# EAGLE design board (EAGLE 7.2.0)
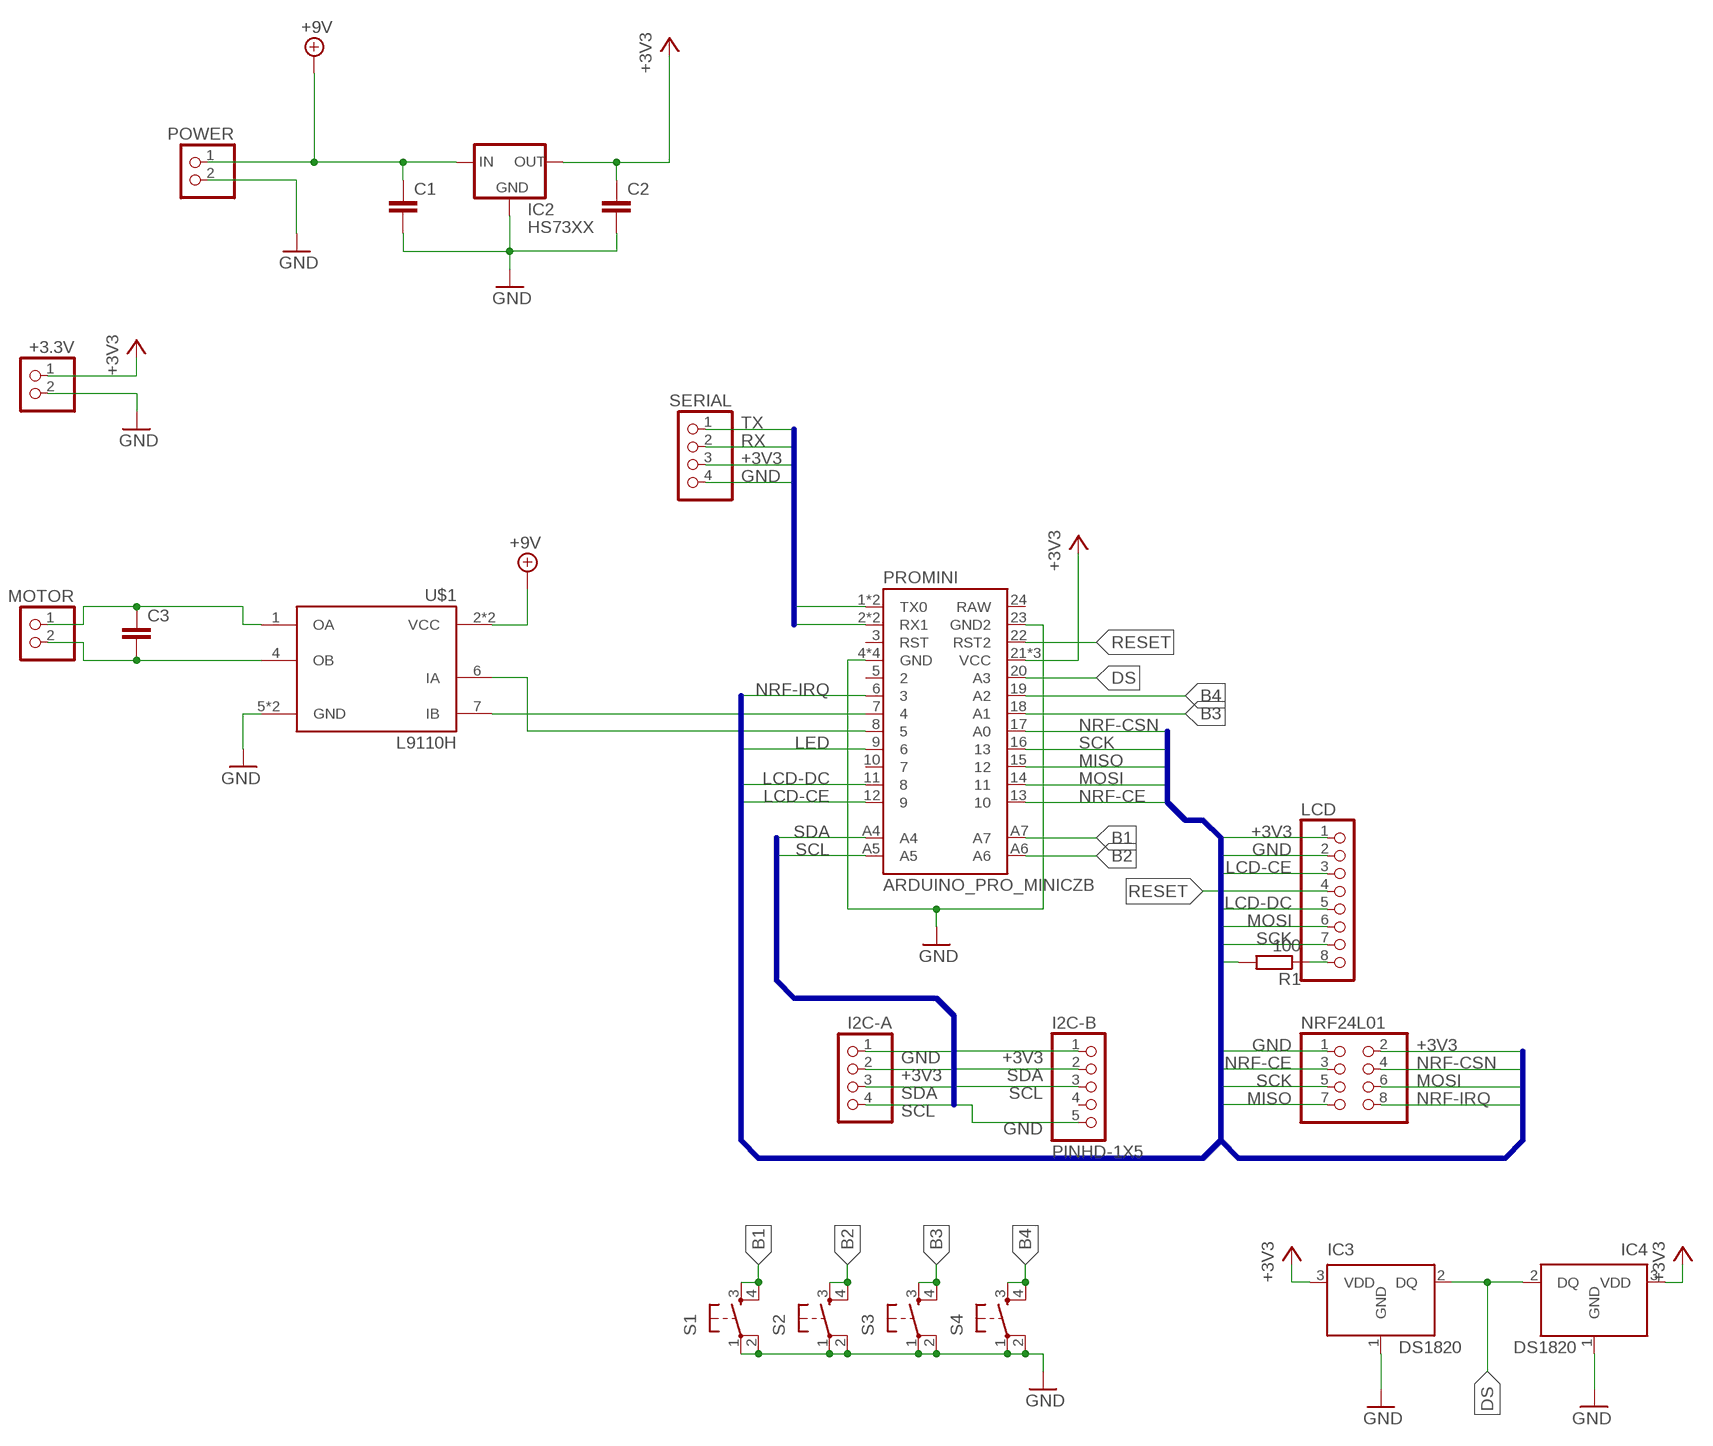
[diagram p0: schematic, sheet 1]

## Parts
+3.3V  PINHD-1X2  [1X02]
C1  C-EU025-024X044  [C025-024X044]
C2  C-EU025-024X044  [C025-024X044]
C3  C-EU025-024X044  [C025-024X044]
I2C-A  PINHD-1X4  [1X04]
I2C-B  PINHD-1X5  [1X05]
IC2  HS73XX  [TO92]
IC3  DS1820  [TO-92]
IC4  DS1820  [TO-92]
LCD  PINHD-1X8  [1X08]
MOTOR  PINHD-1X2  [1X02]
NRF24L01  PINHD-2X4  [2X04]
POWER  PINHD-1X2  [1X02]
PROMINI  ARDUINO_PRO_MINICZB  [PRO_MINI_2]
R1  100  R-EU_0204/7  [0204/7]
S1  TAC_SWITCHPTH  [TACTILE-PTH]
S2  TAC_SWITCHPTH  [TACTILE-PTH]
S3  TAC_SWITCHPTH  [TACTILE-PTH]
S4  TAC_SWITCHPTH  [TACTILE-PTH]
SERIAL  PINHD-1X4  [1X04]
U$1  L9110H  [DIL08]

## Nets
1Y: C3.1 MOTOR.1 U$1.1(OA)
2Y: C3.2 MOTOR.2 U$1.4(OB)
+3V3: +3.3V.1 C2.1 I2C-A.2 I2C-B.1 IC2.3(OUT) IC3.3(VDD) IC4.3(VDD) LCD.1 NRF24L01.2 PROMINI.21(VCC) PROMINI.V(VCC) PROMINI.VCC SERIAL.3
+9V: C1.1 IC2.2(IN) POWER.1 U$1.2(VCC) U$1.3(VCC)
B1: PROMINI.A7 S1.3 S1.4
B2: PROMINI.A6 S2.3 S2.4
B3: PROMINI.18(A1) S3.3 S3.4
B4: PROMINI.19(A2) S4.3 S4.4
DS: IC3.2(DQ) IC4.2(DQ) PROMINI.20(A3)
GND: +3.3V.2 C1.2 C2.2 I2C-A.1 I2C-B.5 IC2.1(GND) IC3.1(GND) IC4.1(GND) LCD.2 NRF24L01.1 POWER.2 PROMINI.4(GND) PROMINI.23(GND2) PROMINI.BLK(GND) PROMINI.G(GND) PROMINI.GND S1.1 S1.2 S2.1 S2.2 S3.1 S3.2 S4.1 S4.2 SERIAL.4 U$1.5(GND) U$1.8(GND)
LCD-CE: LCD.3 PROMINI.12
LCD-DC: LCD.5 PROMINI.11
LED: PROMINI.9 R1.2
LED-LCD: LCD.8 R1.1
MISO: NRF24L01.7 PROMINI.15
MOSI: LCD.6 NRF24L01.6 PROMINI.14
N$1: PROMINI.8 U$1.6(IA)
N$3: PROMINI.7 U$1.7(IB)
NRF-CE: NRF24L01.3 PROMINI.13
NRF-CSN: NRF24L01.4 PROMINI.17(A0)
NRF-IRQ: NRF24L01.8 PROMINI.6
RESET: LCD.4 PROMINI.22(RST2)
RX: PROMINI.2(RX1) PROMINI.RXI(RX1) SERIAL.2
SCK: LCD.7 NRF24L01.5 PROMINI.16
SCL: I2C-A.4 I2C-B.3 PROMINI.A5
SDA: I2C-A.3 I2C-B.2 PROMINI.A4
TX: PROMINI.1(TX0) PROMINI.TXO(TX0) SERIAL.1
Unconnected: I2C-B.4 PROMINI.3(RST) PROMINI.5 PROMINI.10 PROMINI.24(RAW)

## Buses
SDA,SCL,+3V3,GND
+3V3,GND,SCK,MISO,MOSI,NRF-CE,NRF-CSN,NRF-IRQ,LCD-CE,LCD-DC,LED
TX,RX,+3V3,GND

## Library data of the parts
+3.3V MOTOR POWER = pinhead:PINHD-1X2: PIN HEADER
C1-C3 = rcl:C-EU: CAPACITOR, European symbol
I2C-A SERIAL = board:PINHD-1X4: PIN HEADER
I2C-B = board:PINHD-1X5
IC2 = board:HS73XX
IC3 IC4 = DS1820:DS1820: DS1820 - 1-Wire Digital Thermometer
LCD = board:PINHD-1X8: PIN HEADER
NRF24L01 = board:PINHD-2X4: PIN HEADER
PROMINI = board:ARDUINO_PRO_MINI: Chinese version of the Arduino Mini Pro Link to eBay item <http://www.ebay.it/itm/131053554958>
R1 = rcl:R-EU_: RESISTOR, European symbol
S1-S4 = SparkFun-Electromechanical:TAC_SWITCH: Momentary Switch Button commonly used for reset or general input. Spark Fun Electronics SKU : COM-00097 SMT- SWCH-08247
U$1 = board:L9110H

## Net classes
0 default: clearance 0.205 mm

## Board
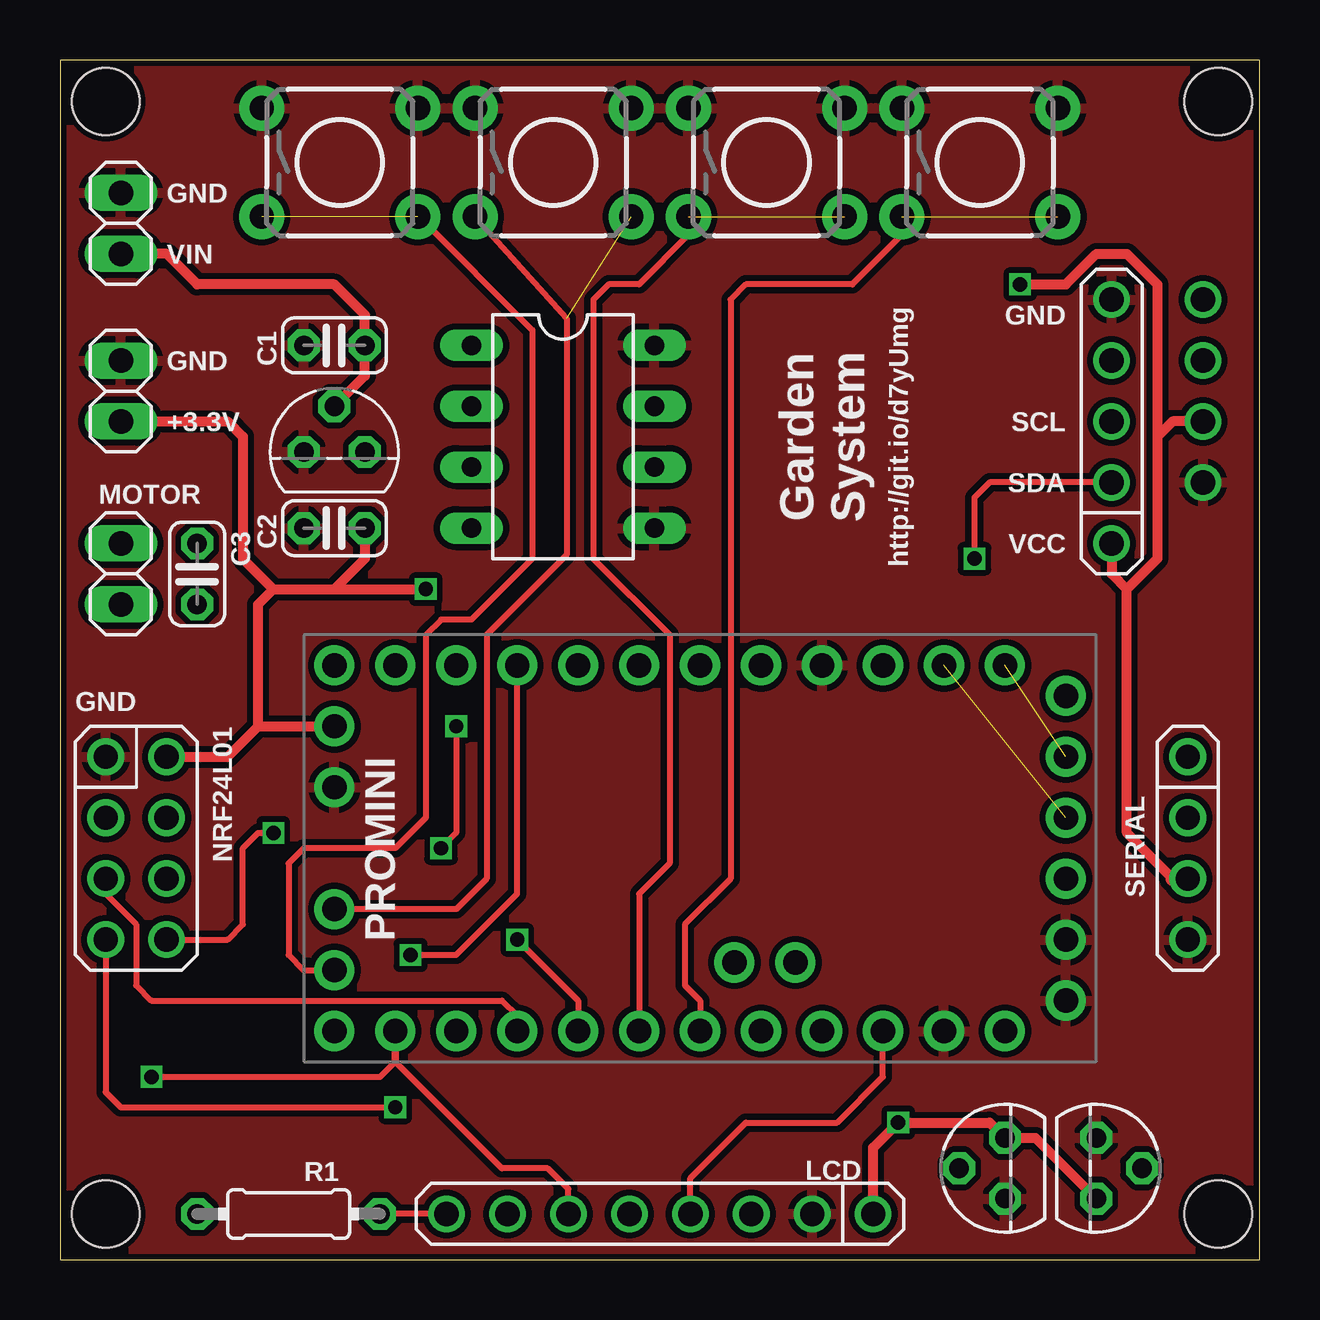
[diagram p1: board, top side]
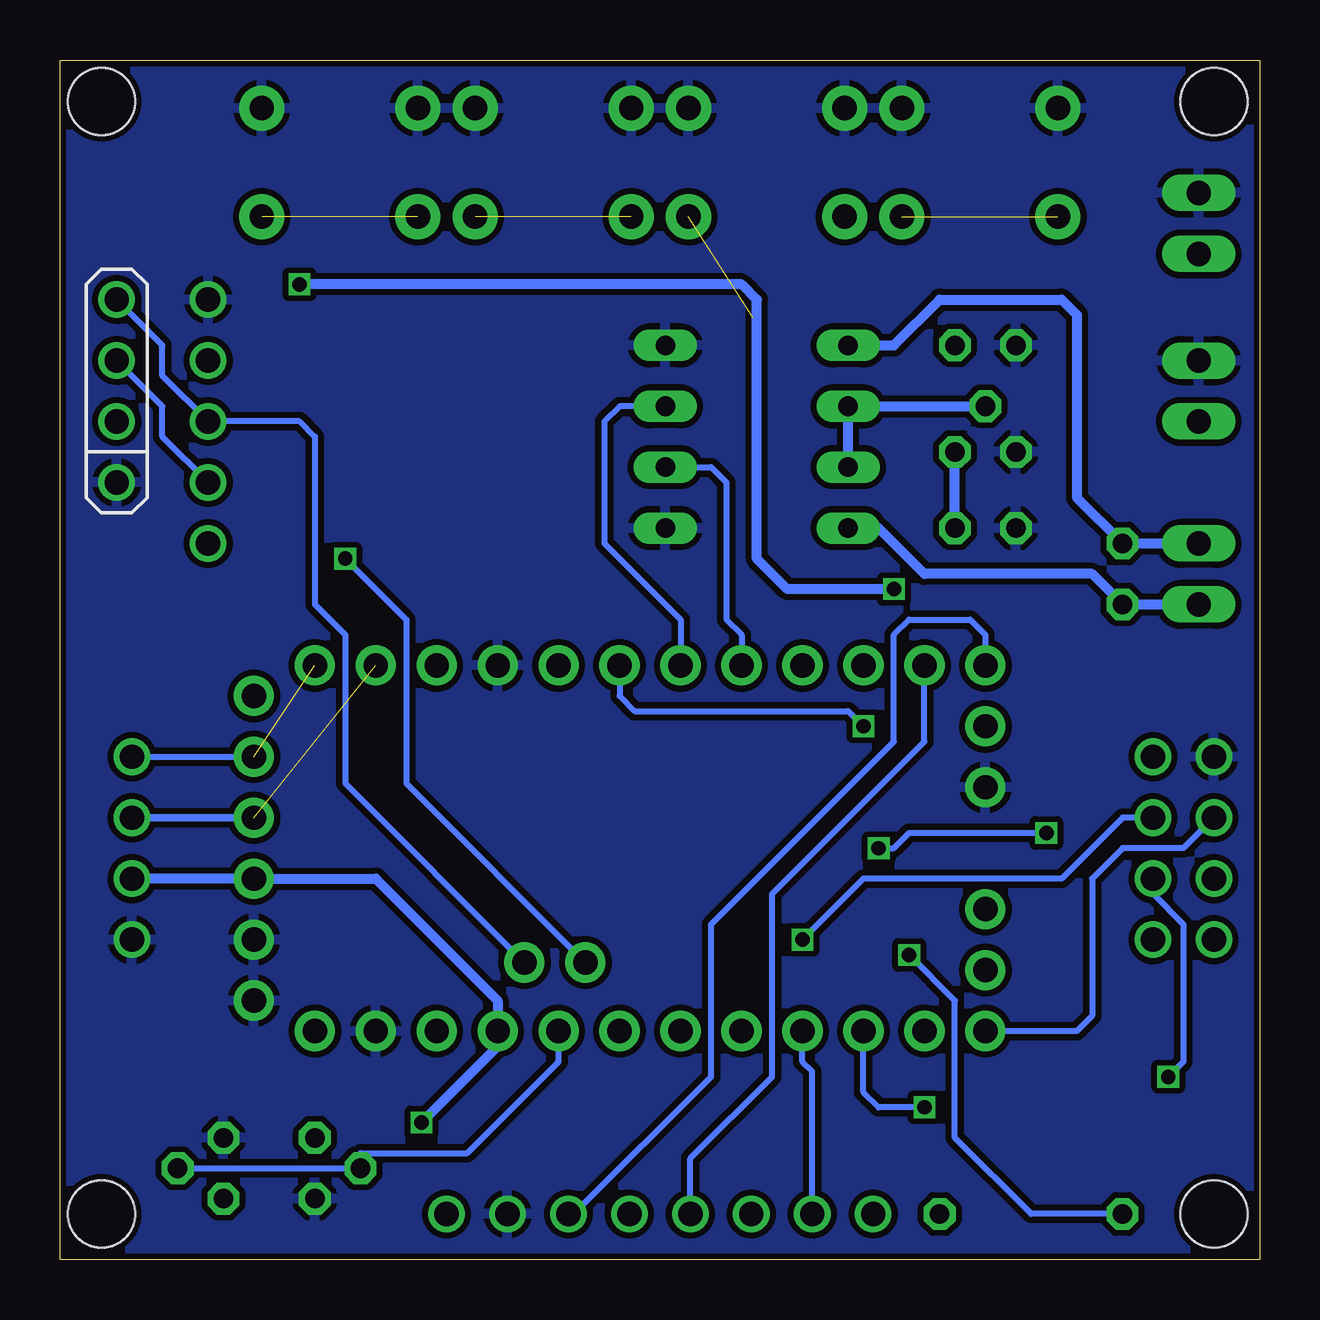
[diagram p2: board, bottom side, seen from below]

Size 49.99 x 49.99 mm. Coordinates in mm from the lower left corner, seen from the top.
Outline: 0,0 49.99,0 49.99,49.99 0,49.99 0,0
Copper layers (1*16): Top 0.035mm / dielectric 1.5mm / Bottom 0.035mm
Design rules "ITEADstudio_DRC": minimum track width 6mil, minimum drill 12mil, track to track 6mil, track to pad 6mil, pad to pad 6mil, via to via 6mil, smd to smd 0mil, copper to edge 10mil, drill to drill 10mil, minimum pad ring 10mil, minimum via ring 6mil, stop-mask expansion 2mil, vias tented up to drill 100mil, thermal gap 10mil
Holes 2.8 mm at 48.26,1.91 1.91,48.26 48.26,48.26 1.91,1.91

### Footprints (pad centres in the part's own frame; a part is rotated, then mirrored left to right if it is on the bottom)
1X02 = drill 1.016 long: 1 -1.27,0; 2 1.27,0
C025-024X044 = drill 0.813 octagon: 1 -1.27,0; 2 1.27,0
1X04 = drill 1.016: 1 -3.81,0; 2 -1.27,0; 3 1.27,0; 4 3.81,0
1X05 = drill 1.016: 1 -5.08,0; 2 -2.54,0; 3 0,0; 4 2.54,0; 5 5.08,0
TO92 = drill 0.813 octagon: 1 -1.27,-0.635; 2 0,1.27; 3 1.27,-0.635
TO-92 = drill 0.813 pad 1.27 octagon: 1 -1.27,0; 2 0,1.905; 3 1.27,0
1X08 = drill 1.016: 1 -8.89,0; 2 -6.35,0; 3 -3.81,0; 4 -1.27,0; 5 1.27,0; 6 3.81,0; 7 6.35,0; 8 8.89,0
2X04 = drill 1.016: 1 -3.81,-1.27; 2 -3.81,1.27; 3 -1.27,-1.27; 4 -1.27,1.27; 5 1.27,-1.27; 6 1.27,1.27; 7 3.81,-1.27; 8 3.81,1.27
PRO_MINI_2 = drill 1.016 pad 1.676: 1 -7.62,12.7; 2 -7.62,10.16; 3 -7.62,7.62; 4 -7.62,5.08; 5 -7.62,2.54; 6 -7.62,0; 7 -7.62,-2.54; 8 -7.62,-5.08; 9 -7.62,-7.62; 10 -7.62,-10.16; 11 -7.62,-12.7; 12 -7.62,-15.24; 13 7.62,-15.24; 14 7.62,-12.7; 15 7.62,-10.16; 16 7.62,-7.62; 17 7.62,-5.08; 18 7.62,-2.54; 19 7.62,0; 20 7.62,2.54; 21 7.62,5.08; 22 7.62,7.62; 23 7.62,10.16; 24 7.62,12.7; A4 4.763,1.429; A5 4.763,3.969; A6 2.54,-15.24; A7 5.08,-15.24; BLK 6.35,15.24; G -2.54,-15.24; GND 3.81,15.24; GRN -6.35,15.24; RXI -1.27,15.24; TXO -3.81,15.24; V -5.08,-15.24; VCC 1.27,15.24
0204/7 = drill 0.813 octagon: 1 -3.81,0; 2 3.81,0
TACTILE-PTH = drill 1.016 pad 1.88: 1 -3.251,2.261; 2 3.251,2.261; 3 -3.251,-2.261; 4 3.251,-2.261
DIL08 = drill 0.813 long: 1 -3.81,-3.81; 2 -1.27,-3.81; 3 1.27,-3.81; 4 3.81,-3.81; 5 3.81,3.81; 6 1.27,3.81; 7 -1.27,3.81; 8 -3.81,3.81

### Placement (x,y rotation side)
+3.3V  2.54,36.2 90 top
C1  11.43,38.1 180 top
C2  11.43,30.48 180 top
C3  5.71,28.57 270 top
I2C-A  47.62,36.2 90 bottom
I2C-B  43.81,34.92 90 top
IC2  11.43,34.29 0 top
IC3  39.37,3.81 90 top
IC4  43.18,3.81 270 top
LCD  24.99,1.91 180 top
MOTOR  2.54,28.57 270 top
NRF24L01  3.17,17.14 270 top
POWER  2.54,43.18 90 top
PROMINI  26.67,17.14 270 top
R1  9.53,1.91 180 top
S1  11.66,45.72 0 top
S2  20.55,45.72 0 top
S3  29.44,45.72 0 top
S4  38.33,45.72 0 top
SERIAL  46.99,17.14 270 top
U$1  20.95,34.29 270 top

### Tracks (layer width: path | path; a pad name or v marks a point on that pad's centre or on a via)
1Y
  Bottom 0.406: MOTOR.1 C3.1 7.62,31.75 7.62,39.37 8.26,40.01 13.34,40.01 15.24,38.1 U$1.1
2Y
  Bottom 0.406: MOTOR.2 C3.2 6.99,28.57 13.97,28.57 15.88,30.48 U$1.4
+3V3  (via drill 0.6)
  Top 0.406: 46.35,15.88 44.45,17.78 44.45,27.94 | LCD.1 33.88,4.67 v34.92,5.71 38.73,5.71 IC3.3 40.64,5.08 IC4.3 | I2C-A.2 46.35,34.92 45.72,34.29 | 45.72,34.29 45.72,29.21 44.45,27.94 | C2.1 12.7,29.21 11.43,27.94 | 11.43,27.94 v15.24,27.94 | v40.01,40.64 41.91,40.64 43.18,41.91 44.45,41.91 45.72,40.64 45.72,34.29 | I2C-B.1 43.81,28.57 44.45,27.94 | NRF24L01.2 6.99,20.95 8.26,22.23 | 8.26,22.23 PROMINI.V | 8.26,22.23 8.26,27.3 8.89,27.94 | 8.89,27.94 11.43,27.94 | +3.3V.1 6.99,34.92 7.62,34.29 7.62,29.21 8.89,27.94
  Top 0.61: SERIAL.3 46.35,15.88
  Bottom 0.406: C2.1 IC2.3 | SERIAL.3 PROMINI.VCC 36.83,15.88 31.75,10.79 PROMINI.21 31.75,8.89 v34.92,5.71 | v40.01,40.64 21.59,40.64 20.95,40.01 20.95,29.21 19.68,27.94 v15.24,27.94
+9V
  Top 0.406: IC2.2 12.7,36.83 C1.1 12.7,39.37 11.43,40.64 5.71,40.64 4.45,41.91 POWER.1
  Bottom 0.406: U$1.3 U$1.2 IC2.2
B1  (1 unrouted)
  Top 0.254: PROMINI.A7 10.16,12.06 9.53,12.7 9.53,16.51 10.16,17.14 13.97,17.14 15.24,18.41 15.24,26.04 15.88,26.67 17.14,26.67 19.68,29.21 19.68,38.73 14.96,43.46 S1.4
B2  (1 unrouted)
  Top 0.254: PROMINI.A6 16.51,14.61 17.78,15.88 17.78,26.04 21.11,29.36 21.11,39.22 S2.3
B3  (1 unrouted)
  Top 0.254: PROMINI.18 24.13,15.24 25.4,16.51 25.4,26.04 22.23,29.21 22.23,40.01 22.86,40.64 24.13,40.64 26.19,42.7 S3.3
B4  (1 unrouted)
  Top 0.254: S4.3 35.08,42.7 33.02,40.64 28.57,40.64 27.94,40.01 27.94,15.88 26.04,13.97 26.04,11.43 26.67,10.79 PROMINI.19
DS
  Bottom 0.254: PROMINI.20 29.21,8.26 33.02,4.45 37.47,4.45 IC3.2 IC4.2
GND
  pour Top (isolate 0.254): 0,49.99 49.99,49.99 49.99,0 0,0
  pour Bottom (isolate 0.254): 0,49.99 49.99,49.99 49.99,0 0,0
LCD-CE
  Bottom 0.254: LCD.3 28.57,1.91 22.86,7.62 22.86,13.97 15.24,21.59 15.24,26.04 14.61,26.67 12.06,26.67 11.43,26.04 PROMINI.12
LCD-DC
  Bottom 0.254: LCD.5 23.72,4.22 20.32,7.62 20.32,15.24 13.97,21.59 PROMINI.11
LED  (via drill 0.6)
  Top 0.254: v14.61,12.7 16.51,12.7 19.05,15.24 PROMINI.9
  Bottom 0.254: R1.2 9.53,1.91 12.7,5.08 12.7,10.79 v14.61,12.7
LED-LCD
  Top 0.254: LCD.8 R1.1
MISO  (via drill 0.6)
  Top 0.254: NRF24L01.7 1.91,6.99 2.54,6.35 v13.97,6.35
  Bottom 0.254: v13.97,6.35 15.88,6.35 16.51,6.99 PROMINI.15
MOSI  (via drill 0.6)
  Top 0.254: v3.81,7.62 13.34,7.62 13.97,8.26 18.41,3.81 20.32,3.81 21.18,2.95 LCD.6
  Top 0.305: 13.97,8.26 PROMINI.14
  Bottom 0.254: NRF24L01.6 4.45,15.24 3.17,13.97 3.17,8.26 v3.81,7.62
N$1
  Bottom 0.254: U$1.6 22.86,33.02 22.23,32.38 22.23,26.67 21.59,26.04 PROMINI.8
N$3
  Bottom 0.254: U$1.7 26.67,35.56 27.3,34.92 27.3,29.84 24.13,26.67 PROMINI.7
NRF-CE
  Bottom 0.254: NRF24L01.3 3.17,17.14 5.71,17.14 6.99,15.88 6.99,10.16 7.62,9.53 PROMINI.13
NRF-CSN  (via drill 0.6)
  Top 0.254: v19.05,13.34 21.59,10.79 PROMINI.17
  Bottom 0.254: NRF24L01.4 5.71,18.41 8.26,15.88 16.51,15.88 v19.05,13.34
NRF-IRQ  (via drill 0.6)
  Top 0.254: NRF24L01.8 6.99,13.34 7.62,13.97 7.62,17.14 8.26,17.78 v8.89,17.78 | v16.51,22.23 16.51,17.78 v15.88,17.14
  Bottom 0.254: PROMINI.6 26.67,23.5 26.04,22.86 17.14,22.86 v16.51,22.23 | v15.88,17.14 15.24,17.14 14.61,17.78 v8.89,17.78
RESET
  Top 0.254: LCD.4 26.26,3.4 28.57,5.71 32.38,5.71 34.29,7.62 PROMINI.22
RX  (1 unrouted)
  Bottom 0.305: SERIAL.2 PROMINI.RXI
SCK
  Top 0.254: NRF24L01.5 1.91,15.24 3.17,13.97 3.17,11.43 3.81,10.79 18.41,10.79 19.05,10.16 PROMINI.16
  Bottom 0.254: LCD.7 18.64,7.85 19.05,8.26 PROMINI.16
SCL
  Bottom 0.254: PROMINI.A5 38.1,19.84 38.1,26.04 39.37,27.3 39.37,34.29 40.01,34.92 I2C-B.3 45.72,36.83 45.72,38.1 I2C-A.4
SDA  (via drill 0.6)
  Top 0.254: I2C-B.2 38.73,32.38 38.1,31.75 v38.1,29.21
  Bottom 0.254: v38.1,29.21 35.56,26.67 35.56,19.84 PROMINI.A4 | I2C-B.2 45.72,34.29 45.72,35.56 I2C-A.3
TX  (1 unrouted)
  Bottom 0.254: SERIAL.1 PROMINI.TXO

### Text on the board
tPlace: GND
tNames: GND | VIN | GND | GND | +3.3V | SCL | Garden / System | http://git.io/d7yUmg | SDA | VCC